# EAGLE design ASD2121 (EAGLE 6.3)
DATABASE: ./../../../../../Components/TinyCircuits_Part_Database.txt
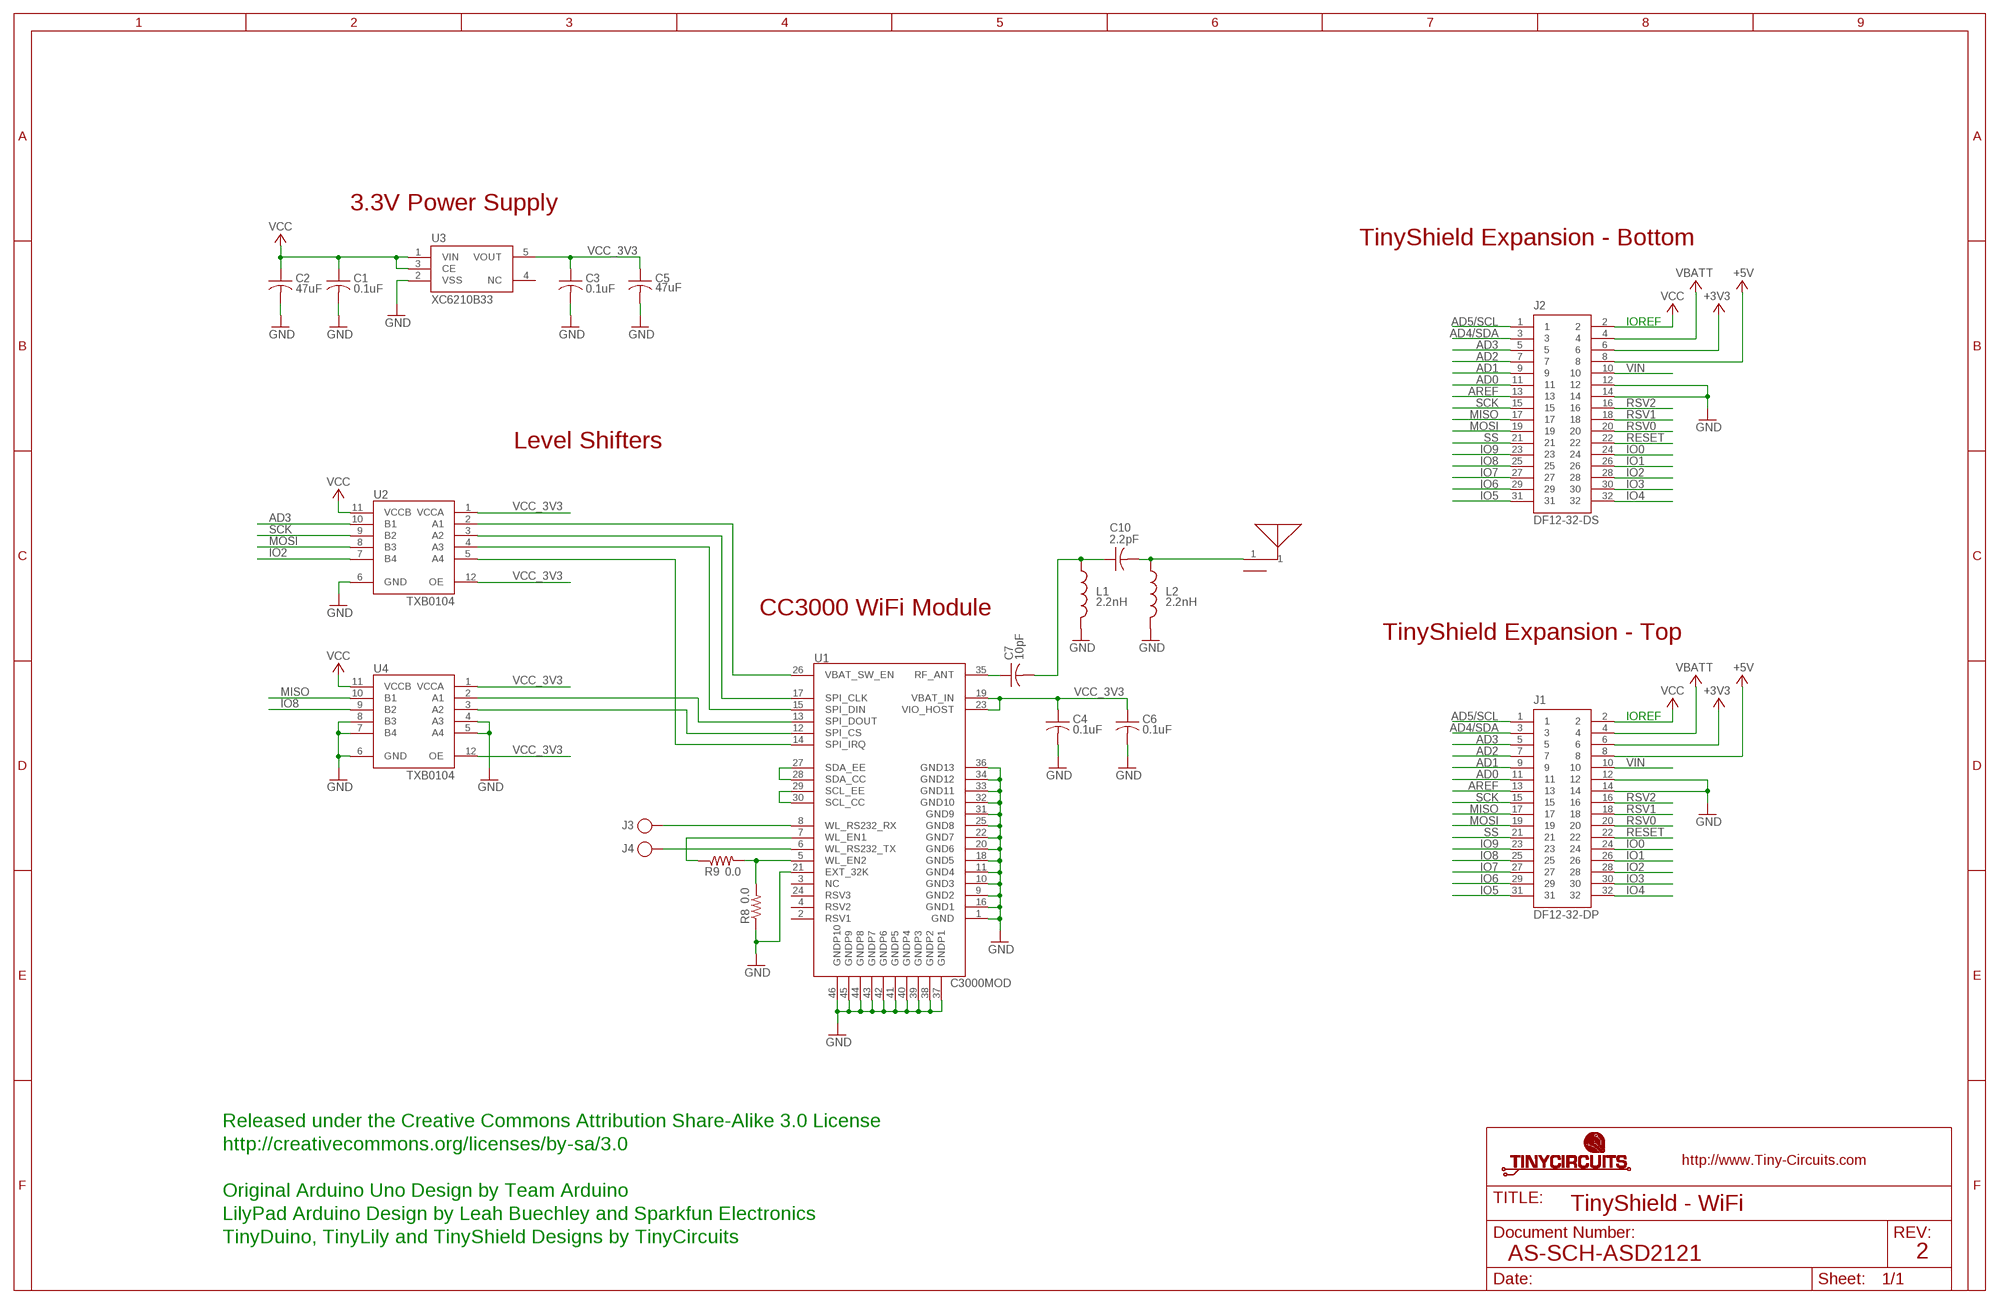
[diagram p0: schematic, sheet 1]

## Parts
ANT1  AS-ITM-00082  [2G4_ANT]
C1  0.1uF  AS-ITM-00008  [C0402]
C2  47uF  AS-ITM-00049  [C1206]
C3  0.1uF  AS-ITM-00008  [C0402]
C4  0.1uF  AS-ITM-00008  [C0402]
C5  47uF  AS-ITM-00049  [C1206]
C6  0.1uF  AS-ITM-00008  [C0402]
C7  10pF  AS-ITM-00107  [C0402]
C10  2.2pF  AS-ITM-00106  [C0402]
J1  DF12-32-DP  AS-ITM-00015  [DF12-32-DP]
J2  DF12-32-DS  AS-ITM-00012  [DF12-32-DS]
J3  PIN_1X.1"SQ_PAD  [TEST_POINT]
J4  PIN_1X.1"SQ_PAD  [TEST_POINT]
L1  2.2nH  AS-ITM-00108  [C0402]
L2  2.2nH  AS-ITM-00108  [C0402]
R8  0.0  AS-ITM-00076  [0402]
R9  0.0  AS-ITM-000760402_SHORT  [0402_SHORT]
U1  C3000MOD  AS-ITM-00079  [CC3000MOD]
U2  TXB0104  AS-ITM-00048  [UQFN-12]
U3  XC6210B33  AS-ITM-00046  [SOT-25]
U4  TXB0104  AS-ITM-00048  [UQFN-12]

## Nets
+3V3: J1.6 J2.6
+5V: J1.8 J2.8
AD0: J1.11 J2.11
AD1: J1.9 J2.9
AD2: J1.7 J2.7
AD3: J1.5 J2.5 U2.10(B1)
AD4/SDA: J1.3 J2.3
AD5/SCL: J1.1 J2.1
AREF: J1.13 J2.13
GND: C1.2 C2.2 C3.2 C4.2 C5.2 C6.2 J1.12 J1.14 J2.12 J2.14 L1.2 L2.2 R8.1 U1.1(GND) U1.9(GND2) U1.10(GND3) U1.11(GND4) U1.16(GND1) U1.18(GND5) U1.20(GND6) U1.21(EXT_32K) U1.22(GND7) U1.25(GND8) U1.31(GND9) U1.32(GND10) U1.33(GND11) U1.34(GND12) U1.36(GND13) U1.37(GNDP1) U1.38(GNDP2) U1.39(GNDP3) U1.40(GNDP4) U1.41(GNDP5) U1.42(GNDP6) U1.43(GNDP7) U1.44(GNDP8) U1.45(GNDP9) U1.46(GNDP10) U2.6(GND) U3.2(VSS) U4.4(A3) U4.5(A4) U4.6(GND) U4.7(B4) U4.8(B3)
IO0: J1.24 J2.24
IO1: J1.26 J2.26
IO2: J1.28 J2.28 U2.7(B4)
IO3: J1.30 J2.30
IO4: J1.32 J2.32
IO5: J1.31 J2.31
IO6: J1.29 J2.29
IO7: J1.27 J2.27
IO8: J1.25 J2.25 U4.9(B2)
IO9: J1.23 J2.23
MISO: J1.17 J2.17 U4.10(B1)
MOSI: J1.19 J2.19 U2.8(B3)
N$1: U1.29(SCL_EE) U1.30(SCL_CC)
N$2: U1.27(SDA_EE) U1.28(SDA_CC)
N$5: U1.14(SPI_IRQ) U2.5(A4)
N$6: U1.12(SPI_CS) U4.3(A2)
N$7: J3.P$1 U1.8(WL_RS232_RX)
N$8: U1.13(SPI_DOUT) U4.2(A1)
N$9: U1.15(SPI_DIN) U2.4(A3)
N$10: J4.P$1 U1.6(WL_RS232_TX)
N$11: R8.2 R9.2 U1.5(WL_EN2)
N$12: R9.1 U1.7(WL_EN1)
N$13: U1.17(SPI_CLK) U2.3(A2)
N$14: U1.26(VBAT_SW_EN) U2.2(A1)
N$15: C7.1 U1.35(RF_ANT)
N$16: C7.2 C10.1 L1.1
N$17: ANT1.1 C10.2 L2.1
RESET: J1.22 J2.22
RSV0: J1.20 J2.20
RSV1: J1.18 J2.18
RSV2: J1.16 J2.16
SCK: J1.15 J2.15 U2.9(B2)
SS: J1.21 J2.21
VBATT: J1.4 J2.4
VCC: C1.1 C2.1 J1.2 J2.2 U2.11(VCCB) U3.1(VIN) U3.3(CE) U4.11(VCCB)
VCC_3V3: C3.1 C4.1 C5.1 C6.1 U1.19(VBAT_IN) U1.23(VIO_HOST) U2.1(VCCA) U2.12(OE) U3.5(VOUT) U4.1(VCCA) U4.12(OE)
VIN: J1.10 J2.10
Unconnected: ANT1.2 U1.2(RSV1) U1.3(NC) U1.4(RSV2) U1.24(RSV3) U3.4(NC)

## Notes on the sheet
- 3.3V Power Supply
- TinyShield Expansion - Bottom
- IOREF
- Level Shifters
- CC3000 WiFi Module
- TinyShield Expansion - Top
- IOREF
- Released under the Creative Commons Attribution Share-Alike 3.0 License
- http://creativecommons.org/licenses/by-sa/3.0
- Original Arduino Uno Design by Team Arduino
- TinyShield - WiFi
- LilyPad Arduino Design by Leah Buechley and Sparkfun Electronics
- TinyDuino, TinyLily and TinyShield Designs by TinyCircuits
- AS-SCH-ASD2121 | 2

## Library data of the parts
ANT1 = tinycircuits:AS-ITM-00082: Antennas WIMAX 2300-2700MHz; PARTNO: AS-ITM-00082; VALUE: 2500AT44M0400E
C1 C3 C4 C6 = tinycircuits:AS-ITM-00008: CAP CER 0.1UF 16V 10% X5R 0402; PARTNO: AS-ITM-00008
C2 C5 = tinycircuits:AS-ITM-00049: CAP CER 47UF 6.3V 20% X6S 1206; PARTNUM: AS-ITM-00049
C7 = tinycircuits:AS-ITM-00107: CAP CER 10PF 50V NP0 0402; PARTNO: AS-ITM-00107
C10 = tinycircuits:AS-ITM-00106: CAP CER 2.2PF 50V NP0 0402; PARTNO: AS-ITM-00106
J1 = tinycircuits:AS-ITM-00015: CONN HEADER 32POS 3MM SMD 0.5MM; PARTNO: AS-ITM-00015
J2 = tinycircuits:AS-ITM-00012: CONN RECEPT 32POS 3MM SMD 0.5MM; PARTNO: AS-ITM-00012
J3 J4 = tinycircuits:PIN_1X.1": 1 Pin 0.100" Header
L1 L2 = tinycircuits:AS-ITM-00108: INDUCTOR MULTILAYER 2.2NH 0402; PARTNO: AS-ITM-00108
R8 = tinycircuits:AS-ITM-00076: RES 0.0 OHM 1/16W 1% 0402 SMD; PARTNO: AS-ITM-00076
R9 = tinycircuits:AS-ITM-00076: RES 0.0 OHM 1/16W 1% 0402 SMD
U1 = tinycircuits:AS-ITM-00079: TI SimpleLink™ CC3000 Module – Wi-Fi 802.11b/g Network Processor; PARTNO: AS_ITM-00079
U2 U4 = tinycircuits:AS-ITM-00048: IC VOLT-LEVEL TRANSLATOR 12UQFN; PARTNO: AS-ITM-00048
U3 = tinycircuits:AS-ITM-00046: IC REG LDO 3.3V .7A SOT-25; PARTNO: AS-ITM-00046

## Board
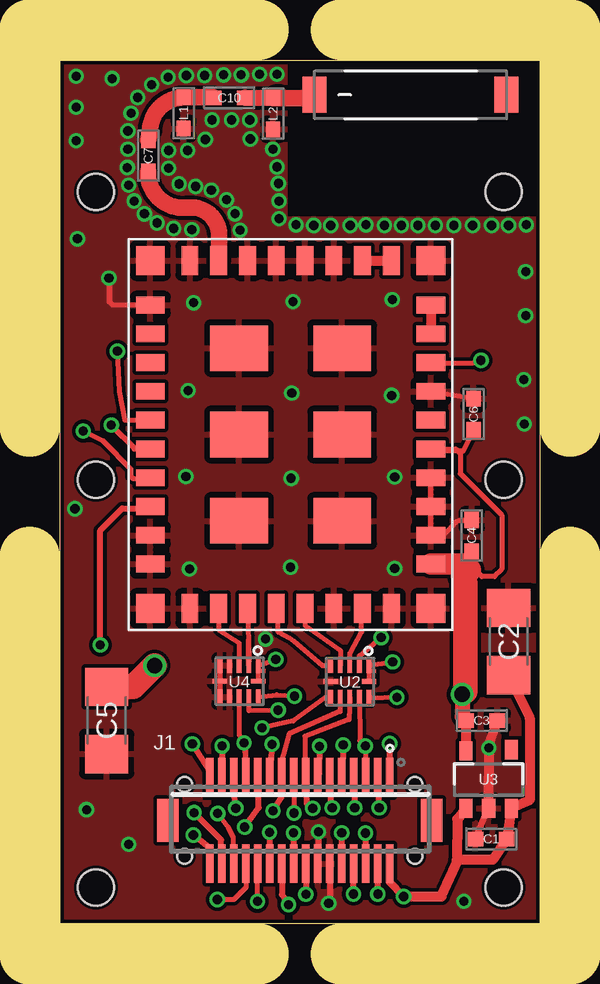
[diagram p1: board, top side]
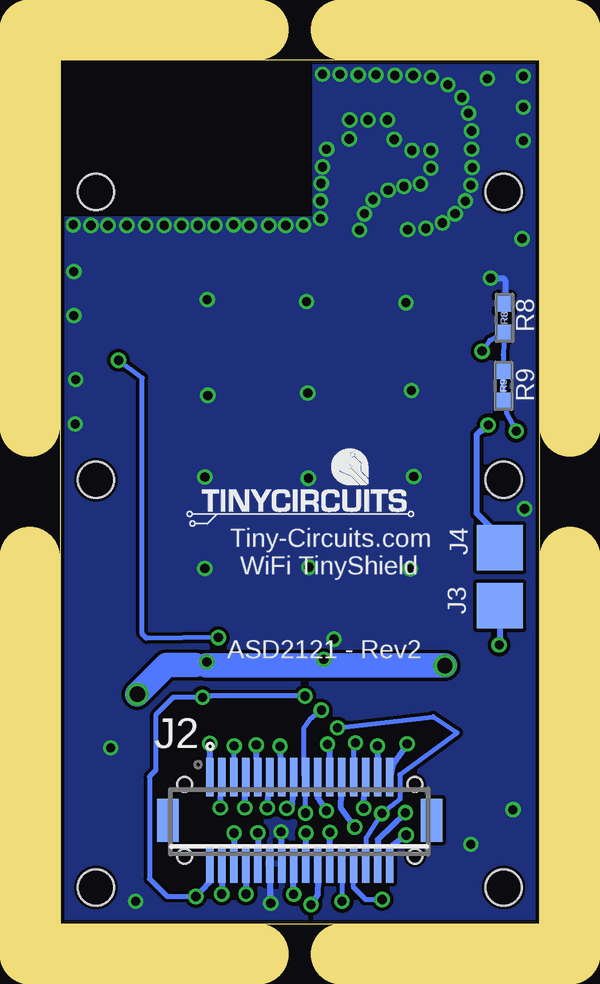
[diagram p2: board, bottom side, seen from below]

Size 20 x 36 mm. Coordinates in mm from the lower left corner, seen from the top.
Outline: 0,36 20,36 20,0 0,0 0,36
Copper layers (1*16): Top 0.035mm / dielectric 1.5mm / Bottom 0.035mm
Design rules "default *": minimum track width 8mil, minimum drill 15mil, track to track 6mil, track to pad 6mil, pad to pad 6mil, via to via 6mil, smd to smd 6mil, copper to edge 6mil, drill to drill 8mil, minimum pad ring 10mil, minimum via ring 5mil, stop-mask expansion 4mil, vias tented up to drill 25mil, thermal gap 10mil
Holes 1.5 mm at 1.5,18.5 18.5,18.5 18.5,1.5 1.5,1.5 1.5,30.5 18.5,30.5
tKeepout: area 9.5,29.5 to 20,36
bKeepout: area 9.5,29.5 to 20,36
tRestrict: area 9.5,29.5 to 20,36; area 3.2,31.7 to 4.2,32.3; area 6.8,33.9 to 7.3,34.9
bRestrict: area 9.5,29.5 to 20,36
Milling: 8 lines

### Footprints (pad centres in the part's own frame; a part is rotated, then mirrored left to right if it is on the bottom)
2G4_ANT = smd 1 x 1.5: 1 -4,0; 2 4,0
C0402 = smd 0.65 x 0.6: 1 -0.65,0; 2 0.65,0
C1206 = smd 1.6 x 1.8: 1 -1.4,0; 2 1.4,0
DF12-32-DP = smd 0.3 x 1.6: 1 -3.75,-1.8; 2 -3.75,1.8; 3 -3.25,-1.8; 4 -3.25,1.8; 5 -2.75,-1.8; 6 -2.75,1.8; 7 -2.25,-1.8; 8 -2.25,1.8; 9 -1.75,-1.8; 10 -1.75,1.8; 11 -1.25,-1.8; 12 -1.25,1.8; 13 -0.75,-1.8; 14 -0.75,1.8; 15 -0.25,-1.8; 16 -0.25,1.8; 17 0.25,-1.8; 18 0.25,1.8; 19 0.75,-1.8; 20 0.75,1.8; 21 1.25,-1.8; 22 1.25,1.8; 23 1.75,-1.8; 24 1.75,1.8; 25 2.25,-1.8; 26 2.25,1.8; 27 2.75,-1.8; 28 2.75,1.8; 29 3.25,-1.8; 30 3.25,1.8; 31 3.75,-1.8; 32 3.75,1.8 | smd 0.9 x 1.8: F1 -5.5,0; F2 5.5,0 | hole 0.6: -4.8,1.5; 4.8,1.5
DF12-32-DS = smd 0.3 x 1.6: 1 -3.75,1.8; 2 -3.75,-1.8; 3 -3.25,1.8; 4 -3.25,-1.8; 5 -2.75,1.8; 6 -2.75,-1.8; 7 -2.25,1.8; 8 -2.25,-1.8; 9 -1.75,1.8; 10 -1.75,-1.8; 11 -1.25,1.8; 12 -1.25,-1.8; 13 -0.75,1.8; 14 -0.75,-1.8; 15 -0.25,1.8; 16 -0.25,-1.8; 17 0.25,1.8; 18 0.25,-1.8; 19 0.75,1.8; 20 0.75,-1.8; 21 1.25,1.8; 22 1.25,-1.8; 23 1.75,1.8; 24 1.75,-1.8; 25 2.25,1.8; 26 2.25,-1.8; 27 2.75,1.8; 28 2.75,-1.8; 29 3.25,1.8; 30 3.25,-1.8; 31 3.75,1.8; 32 3.75,-1.8 | smd 0.9 x 1.8: F1 -5.5,0; F2 5.5,0 | hole 0.6: -4.8,1.5; 4.8,1.5
TEST_POINT = smd 1.905 x 1.905: P$1 0,0
0402 = smd 0.65 x 0.55: 1 -0.6,0; 2 0.6,0
0402_SHORT = smd 0.65 x 0.55: 1 -0.6,0; 2 0.6,0
CC3000MOD = smd 1.2 x 0.7: 1 -5.9,5.55; 2 -5.9,4.35; 3 -5.9,3.15; 4 -5.9,1.95; 5 -5.9,0.75; 6 -5.9,-0.45; 7 -5.9,-1.65; 8 -5.9,-2.85; 9 -5.9,-4.05; 10 -5.9,-5.25; 19 5.8,-5.25; 20 5.8,-4.05; 21 5.8,-2.85; 22 5.8,-1.65; 23 5.8,-0.45; 24 5.8,0.75; 25 5.8,1.95; 26 5.8,3.15; 27 5.8,4.35; 28 5.8,5.55 | smd 0.7 x 1.2: 11 -4.25,-7.1; 12 -3.05,-7.1; 13 -1.85,-7.1; 14 -0.65,-7.1; 15 0.55,-7.1; 16 1.75,-7.1; 17 2.95,-7.1; 18 4.15,-7.1; 29 4.15,7.4; 30 2.95,7.4; 31 1.75,7.4; 32 0.55,7.4; 33 -0.65,7.4; 34 -1.85,7.4; 35 -3.05,7.4; 36 -4.25,7.4 | smd 2.4 x 1.9: 37 -2.2,3.75; 38 -2.2,0.15; 39 -2.2,-3.45; 40 2.1,3.75; 41 2.1,0.15; 42 2.1,-3.45 | smd 1.2 x 1.2: 43 -5.9,7.4; 44 -5.9,-7.1; 45 5.8,-7.1; 46 5.8,7.4
UQFN-12 = smd 0.2 x 0.6: 1 -0.8,-0.65; 2 -0.4,-0.65; 3 0,-0.65; 4 0.4,-0.65; 5 0.8,-0.65; 7 0.8,0.65; 8 0.4,0.65; 9 0,0.65; 10 -0.4,0.65; 11 -0.8,0.65 | smd 0.6 x 0.2: 6 0.8,0; 12 -0.8,0
SOT-25 = smd 0.55 x 0.8: 1 -0.95,-1.2; 2 0,-1.2; 3 0.95,-1.2; 4 0.95,1.25; 5 -0.95,1.2

### Placement (x,y rotation side)
ANT1  14.62,34.55 0 top
C1  17.98,3.53 180 top
C2  18.71,11.76 90 top
C3  17.59,8.46 0 top
C4  17.17,16.17 90 top
C5  1.94,8.47 270 top
C6  17.25,21.23 90 top
C7  3.69,32.01 90 top
C10  7.06,34.42 0 top
J1  10,4.3 180 top
J2  10,4.3 0 bottom
J3  1.66,13.25 0 bottom
J4  1.66,15.66 0 bottom
L1  5.16,33.79 270 top
L2  8.89,33.76 270 top
R8  1.47,25.24 270 bottom
R9  1.5,22.42 90 bottom
U1  9.67,20.24 0 top
U2  12.08,10.09 180 top
U3  17.87,6 0 top
U4  7.47,10.11 180 top
U$1  [DOCFIELD-TINYCIRCUITS-PCB]  33.91,-10 0 top  (outside the outline)

### Tracks (layer width: path | path; a pad name or v marks a point on that pad's centre or on a via)
+3V3  (via drill 0.38)
  Top 0.254: J2.6 v12.75,3.77 v12.74,3.77
  Bottom 0.254: v12.74,3.77 12.74,2.51 J2.6
+5V  (via drill 0.38)
  Top 0.254: v12.24,1.23 J2.8
  Bottom 0.254: J2.8 12.25,1.21 v12.24,1.23
AD0  (via drill 0.38)
  Top 0.254: v11.35,4.83 11.31,5.05 J2.11
  Bottom 0.254: J2.11 11.28,5.79 v11.35,4.83
AD1  (via drill 0.38)
  Top 0.254: J2.9 11.79,6.27 v11.81,7.44
  Bottom 0.254: v11.81,7.44 11.78,6.22 J2.9
AD2  (via drill 0.38)
  Top 0.254: v12.29,4.83 12.31,5.05 J2.7
  Bottom 0.254: J2.7 12.27,5.86 v12.29,4.83
AD3  (via drill 0.38)
  Top 0.203: U2.10 12.51,7.62 v12.73,7.4 12.73,6.12 J2.5
  Bottom 0.203: J2.5 12.75,7.38 v12.73,7.4
AD4/SDA  (via drill 0.38)
  Top 0.254: v13.31,4.83 13.31,5 J2.3
  Bottom 0.254: J2.3 13.28,5.86 v13.31,4.83
AD5/SCL  (via drill 0.38)
  Top 0.254: v13.75,7.5 J2.1
  Bottom 0.254: J2.1 v13.75,7.5
AREF  (via drill 0.38)
  Top 0.254: J2.13 10.8,6.27 v10.82,7.39
  Bottom 0.254: v10.82,7.39 10.77,6.59 J2.13
GND  (via drill 0.38)
  Top 0.203: U4.5 U4.6 U4.7 | U1.22 U1.21 U1.20 15.98,16.18 16.59,16.8 17.14,16.8 C4.2 | C6.2 15.49,22.16 U1.25 | U1.1 2.2,25.78 2.06,25.92
  Top 0.254: v11.21,0.85 11.21,1 11.25,1.04 J2.12 11.25,0.86 v11.21,0.85 | v11.21,0.85 11.21,0.79 11.23,0.77 | C1.2 U3.2 | v10.78,3.82 J2.14 | 2.06,25.92 2.06,26.88 v2.04,26.91
  Top 0.406: C3.2 17.89,7.5 U3.2
  Bottom 0.254: 11.25,1.79 11.25,0.86 v11.21,0.85 | J2.14 v10.78,3.82 | v2.04,26.91 1.51,26.91 1.43,26.83 1.43,25.88 R8.1
  other vias: 17.89,7.32 16.85,0.92 8.88,32.28 7.94,32.71 7.91,33.5 7.15,33.5 6.34,33.5 6.06,32.69 5.32,32.23 4.54,32.23 9.06,35.4 8.32,35.4 7.56,35.38 6.82,35.38 6.03,35.35 5.27,35.35 4.51,35.28 3.82,34.97 3.24,34.44 2.96,33.78 2.83,33.04 2.83,32.28 2.81,31.52 2.86,30.78 3.09,30.12 3.52,29.59 4.05,29.21 4.74,28.98 5.5,28.93 7.51,28.9 7.3,29.59 6.95,30.17 6.31,30.58 5.65,30.73 4.97,30.83 4.54,31.49 9.06,31.54 9.11,30.86 9.13,30.12 9.13,29.38 9.84,29.13 10.58,29.1 11.29,29.1 12.11,29.1 12.77,29.13 18,29.1 18.71,29.1 19.45,29.13 19.42,27.17 19.42,25.35 5.58,25.88 9.72,25.93 13.86,26.01 13.83,22.02 9.67,22.12 5.35,22.22 5.25,18.64 9.64,18.56 13.96,18.61 5.4,14.78 9.62,14.86 13.96,14.8 19.37,20.82 19.34,22.68 0.73,28.55 0.62,17.29 0.68,35.33 0.68,34.03 0.68,32.63 2.17,35.23 1.11,4.75 2.86,3.3 13.53,29.1 14.24,29.1 14.92,29.1 15.66,29.1 16.42,29.1 17.21,29.1 8.57,11.86
  pour Top: 0.25,35.75 19.75,35.75 19.75,0.25 0.25,0.25
  pour Bottom: 0.25,35.75 19.75,35.75 19.75,0.25 0.25,0.25
IO0  (via drill 0.38)
  Top 0.203: v8.24,0.92 8.24,2.49 J2.24
  Bottom 0.203: J2.24 8.25,0.94 v8.24,0.92
IO1  (via drill 0.38)
  Top 0.203: J2.26 7.75,1.5 7.25,1 v6.56,1
  Bottom 0.203: v6.56,1 7.27,1 7.27,1.02 7.75,1.51 J2.26
IO2  (via drill 0.38)
  Top 0.203: U2.7 11.09,9.44 9.73,8.45 v8.43,8.15 | v6.58,4.59 7.02,4.02 7.22,3.56 J2.28
  Bottom 0.203: v8.43,8.15 8.45,8.16 4.43,8.62 3.44,7.96 5.82,6.2 5.82,5.18 v6.58,4.59 7.22,3.57 J2.28
IO3  (via drill 0.38)
  Top 0.254: J2.30 6.73,3.49 v5.6,4.62
  Bottom 0.254: v5.6,4.62 6.75,3.51 6.77,2.53 J2.30
IO4  (via drill 0.38)
  Top 0.254: J2.32 6.25,3.14 v5.56,3.69
  Bottom 0.254: v5.56,3.69 5.61,3.65 6.21,3.18 6.21,3.14 6.26,3.1 J2.32
IO5  (via drill 0.38)
  Top 0.254: v5.52,7.49 6.23,6.38 J2.31
  Bottom 0.254: J2.31 6.11,6.64 v5.52,7.49
IO6  (via drill 0.38)
  Top 0.254: J2.29 6.76,6.11 v6.76,7.4
  Bottom 0.254: J2.29 6.75,7.39 v6.76,7.4
IO7  (via drill 0.38)
  Top 0.254: v7.34,4.81 7.31,4.9 J2.27
  Bottom 0.254: J2.27 7.28,5.76 v7.34,4.81
IO8  (via drill 0.38)
  Top 0.203: U4.9 7.48,7.86 v7.68,7.53 | v7.68,7.53 7.75,7.52 J2.25 7.78,6.13 v7.68,7.53
  Bottom 0.203: J2.25 7.75,7.52 v7.68,7.53
IO9  (via drill 0.38)
  Top 0.254: v7.7,4.02 8.28,4.83 J2.23
  Bottom 0.254: J2.23 8.28,4.82 v7.7,4.02
MISO  (via drill 0.38)
  Top 0.203: U4.10 7.87,8.88 v9.1,8.9 | J2.17 9.75,4.52 v9.76,4.61
  Bottom 0.203: v9.1,8.9 9.58,8.49 9.84,8.14 9.84,6.19 J2.17 9.74,6.04 v9.76,4.61
MOSI  (via drill 0.38)
  Top 0.203: U2.8 11.68,8.84 9.56,7.91 9.33,7.07 9.23,6.74 9.23,6.12 J2.19
  Top 0.254: v8.89,4.7 9.23,5.26 J2.19
  Bottom 0.254: J2.19 9.25,5.26 v8.89,4.7
N$1
  Top 0.406: U1.30 U1.29
N$2
  Top 0.406: U1.28 U1.27
N$5
  Top 0.203: U2.5 10.94,10.74 9.76,11.77 9.58,11.89 9.1,12.15 9.1,13.11 U1.14
N$6
  Top 0.203: U1.12 6.62,12.24 7.48,11.69 U4.3
N$7  (via drill 0.38)
  Top 0.254: v1.68,11.61 1.68,16.39 2.6,17.3 3.69,17.3 U1.8
  Bottom 0.254: J3.P$1 1.66,11.64 v1.68,11.61
N$8
  Top 0.203: U4.2 7.87,11.84 7.88,10.9 7.86,13.18 U1.13
N$9
  Top 0.203: U1.15 10.22,12.43 11.69,11.39 11.69,10.76 U2.4
N$10  (via drill 0.38)
  Top 0.254: v2.14,20.79 2.14,20.76 3.11,19.79 U1.6
  Bottom 0.254: J4.P$1 1.66,16.14 2.62,17.1 2.62,20.38 2.45,20.56 2.37,20.56 v2.14,20.79
N$11  (via drill 0.38)
  Top 0.203: v2.39,23.86 2.47,22.18 2.7,20.99 U1.5
  Bottom 0.203: R9.2 1.52,23.72 R8.2 2.08,24.3 v2.39,23.86
N$12  (via drill 0.38)
  Top 0.203: v0.97,20.53 1.81,20.12 2.95,18.96 2.95,18.65 3.06,18.55 3.73,18.55 U1.7
  Bottom 0.203: R9.1 1.37,21.26 v0.97,20.53
N$13
  Top 0.203: U2.3 12.08,11.27 12.58,12.15 12.58,13.1 U1.17
N$14  (via drill 0.38)
  Top 0.203: U2.2 12.48,11.16 v13.39,11.92 | v17.56,23.48 17.18,23.35 15.84,23.35 U1.26
  Bottom 0.203: v13.39,11.92 16.39,11.89 16.57,12.07 16.57,22.74 v17.56,23.48
N$15
  Top 0.686: C7.1 3.69,31.08 arc90 5.32,29.85 5.44,29.85 arc-90 6.64,28.71 6.64,27.67 arc90 U1.35
N$16
  Top 0.406: 6.39,34.44 arc-90 C10.1
  Top 0.686: C7.2 3.76,33.04 arc-90 L1.1 6.39,34.44
N$17
  Top 0.686: C10.2 9.32,34.4 arc90 L2.1 10.64,34.41 arc90 ANT1.1
RESET  (via drill 0.38)
  Top 0.254: v8.74,3.8 J2.22
  Bottom 0.254: J2.22 8.75,3.69 v8.74,3.8
RSV0  (via drill 0.38)
  Top 0.254: J2.20 9.25,1.2 v9.54,0.79
  Bottom 0.254: J2.20 9.25,1.84 9.25,1.2 v9.54,0.79
RSV1  (via drill 0.38)
  Top 0.254: v9.74,3.77 9.74,2.51 J2.18
  Bottom 0.254: J2.18 9.75,3.72 v9.74,3.77
RSV2  (via drill 0.38)
  Top 0.254: J2.16 10.25,1.16 v10.25,1.22
  Bottom 0.254: v10.25,1.22 J2.16
SCK  (via drill 0.38)
  Top 0.203: U2.9 12.06,8.5 10.22,7.8 10.22,6.13 J2.15
  Top 0.254: v10.54,4.8 10.31,4.98 J2.15
  Bottom 0.254: J2.15 10.31,4.95 v10.54,4.8
SS  (via drill 0.38)
  Top 0.254: v8.85,7.48 J2.21
  Bottom 0.254: J2.21 8.75,7.39 v8.85,7.48
VBATT  (via drill 0.38)
  Top 0.254: v13.25,1.23 J2.4
  Bottom 0.254: J2.4 13.25,1.24 v13.25,1.23
VCC  (via drill 0.38)
  Top 0.203: v14.05,9.43 12.95,9.38 U2.11 | U4.11 9.05,9.53 v9.79,9.48
  Top 0.254: 16.54,2.65 16.61,2.68 | J2.2 13.75,1.73
  Top 0.305: 13.75,1.73 v14.33,1.12
  Top 0.406: C2.1 19.59,8.57 19.59,5.14 U3.3 C1.1 18.07,2.68 16.61,2.68 15.91,1.12 v14.33,1.12 | U3.1 16.57,4.35 16.54,2.65
  Bottom 0.203: v9.79,9.48 13.7,9.48 v14.05,9.43 15.27,9.43 16.01,8.69 16.01,6.38 16.26,6.13 16.26,1.86 15.53,1.12 v14.33,1.12
  Bottom 0.254: v14.33,1.12 13.77,1.71 J2.2
VCC_3V3  (via drill 0.38, 0.64)
  Top 0.203: U2.12 U2.1 13.11,10.79 v13.88,10.9 | 16.77,8.63 C3.1 | v9,11.01 U4.1 U4.12 | 16.96,14.98 C4.1 | C4.1 17.37,14.68 | 17.37,14.68 16.9,14.21 | 16.9,9.68 v16.77,9.56 | C4.1 17.37,15.16 17.05,14.84 17.05,14.74 | C6.1 17.2,20.47 16.82,19.69 15.56,19.69 U1.23 16.5,19.79 16.7,19.59 16.7,18.75 18.42,17.03 18.42,14.77 18.12,14.46 17.59,14.46 17.37,14.68
  Top 0.406: C3.1 U3.5
  Top 0.635: v16.77,9.56 16.77,8.63
  Top 0.889: U1.19 16.96,14.98
  Top 1.016: C5.1 3.06,9.86 v3.95,10.75 | 16.9,14.21 16.9,9.68 | 17.05,14.74 16.8,14.49
  Bottom 0.203: 14.36,10.78 14.33,10.75 13.9,10.75 13.85,10.8 v13.88,10.9 | v9,11.01 9.33,10.8 9.38,10.75
  Bottom 1.016: v3.95,10.75 9.38,10.75 13.9,10.75 | 14.36,10.78 15.55,10.78 v16.77,9.56
VIN  (via drill 0.38)
  Top 0.254: J2.10 v11.76,3.78 v11.75,3.78
  Bottom 0.254: v11.75,3.78 J2.10

### Text on the board
bPlace: R8 | R9 | J4 | Tiny-Circuits.com | WiFi TinyShield | J3 | ASD2121 - Rev2
Document: FABRICATION DRAWING | NOTES: | 1. PRINTED CIRCUIT BOARD MADE FROM NEMA GRADE FR-4 EPOXY LAMINATE | WITH 1 OUNCE COPPER PLATING AND .024 THICKNESS. | 2. ALL DIMENSIONS ARE GIVEN IN INCHES. | 3. CIRCUIT PATHS ARE FOR REFERENCE ONLY. | 4. HOLE SIZES SHOWN ARE FINISHED DIAMETERS AFTER PLATING. | 5. BOARD PLATED USING REFLOW OR SIMILAR METHOD. | 6. BOARD TO HAVE BLUE SOLDER MASK ON PLATED SURFACES USING WET FILM | 7. SILKSCREEN BOARD USING WHITE INK. | SR100 OR SR1010 EPOXY. EQUIVALENT WET OR DRY FILM MAY BE USED. | 8. THE FOLLOWING INFORMATION APPLIES TO THIS BOARD: | * 2 COPPER LAYERS | * .024 BOARD THICKNESS | * REQUIRES TOP SIDE SILKSCREEN | Released under the Creative Commons Attribution Share-Alike 3.0 License | http://creativecommons.org/licenses/by-sa/3.0 | Original Arduino Uno Design by Team Arduino | LilyPad Arduino Design by Leah Buechley and Sparkfun Electronics | TinyDuino, TinyLily and TinyShield Designs by TinyCircuits | TinyShield - WiFi | AS-PCB-ASD2121 | 2